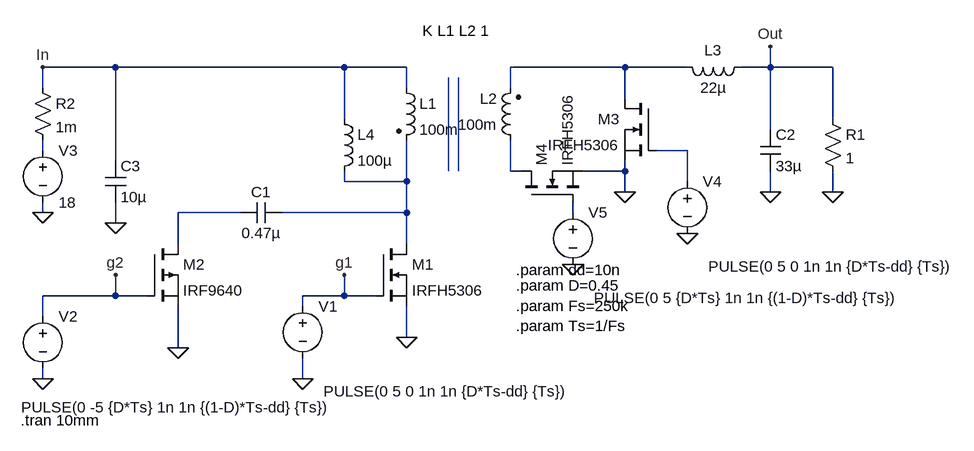
[diagram p0: schematic Forward Active Clamping.asc]
Forward Active Clamping.asc, the LTspice schematic file:
Version 4
SHEET 1 1224 680
WIRE -112 -48 -224 -48
WIRE 240 -48 -112 -48
WIRE 336 -48 240 -48
WIRE 672 -48 496 -48
WIRE 768 -48 672 -48
WIRE 896 -48 896 -80
WIRE 896 -48 848 -48
WIRE 992 -48 896 -48
WIRE -224 -16 -224 -48
WIRE 336 -16 336 -48
WIRE 496 -16 496 -48
WIRE 672 0 672 -48
WIRE 240 32 240 -48
WIRE 992 32 992 -48
WIRE 896 48 896 -48
WIRE -224 80 -224 64
WIRE 768 80 720 80
WIRE -112 96 -112 -48
WIRE 400 112 400 -32
WIRE 416 112 416 -32
WIRE 496 112 496 64
WIRE 512 112 496 112
WIRE 672 112 672 96
WIRE 672 112 608 112
WIRE 240 128 240 112
WIRE 336 128 336 64
WIRE 336 128 240 128
WIRE 768 128 768 80
WIRE 672 144 672 112
WIRE 896 144 896 112
WIRE 992 144 992 112
WIRE -224 176 -224 160
WIRE 80 176 -16 176
WIRE 336 176 336 128
WIRE 336 176 144 176
WIRE 592 176 592 160
WIRE -112 192 -112 160
WIRE -16 224 -16 176
WIRE 336 224 336 176
WIRE -112 304 -112 272
WIRE -112 304 -224 304
WIRE -64 304 -112 304
WIRE 240 304 240 272
WIRE 240 304 176 304
WIRE 288 304 240 304
WIRE 176 320 176 304
WIRE -224 336 -224 304
WIRE 336 368 336 320
WIRE -16 384 -16 320
WIRE -224 432 -224 416
WIRE 176 432 176 400
FLAG 176 432 0
FLAG 336 368 0
FLAG -224 432 0
FLAG -16 384 0
FLAG 896 144 0
FLAG 672 144 0
FLAG 992 144 0
FLAG 896 -80 Out
FLAG -224 -48 In
FLAG -224 176 0
FLAG -112 192 0
FLAG 240 272 g1
FLAG -112 272 g2
FLAG 768 208 0
FLAG 592 256 0
SYMBOL nmos 288 224 R0
SYMATTR InstName M1
SYMATTR Value IRFH5306
SYMBOL pmos -64 224 R0
SYMATTR InstName M2
SYMATTR Value IRF9640
SYMBOL voltage 176 304 R0
WINDOW 3 32 147 Left 2
WINDOW 123 0 0 Left 0
WINDOW 39 0 0 Left 0
SYMATTR InstName V1
SYMATTR Value PULSE(0 5 0 1n 1n {D*Ts-dd} {Ts})
SYMBOL voltage -224 320 R0
WINDOW 3 -33 156 Left 2
WINDOW 123 0 0 Left 0
WINDOW 39 0 0 Left 0
SYMATTR InstName V2
SYMATTR Value PULSE(0 -5 {D*Ts} 1n 1n {(1-D)*Ts-dd} {Ts})
SYMBOL cap 144 160 R90
WINDOW 0 0 32 VBottom 2
WINDOW 3 32 32 VTop 2
SYMATTR InstName C1
SYMATTR Value 0.47µ
SYMATTR SpiceLine V=10 Irms=1.19 Rser=0.0746214 Lser=0 mfg="KEMET" pn="C0603C474K8RAC" type="X7R"
SYMBOL cap 880 48 R0
SYMATTR InstName C2
SYMATTR Value 33µ
SYMBOL ind2 320 -32 R0
SYMATTR InstName L1
SYMATTR Value 100m
SYMATTR Type ind
SYMBOL ind2 512 80 R180
WINDOW 0 36 80 Left 2
WINDOW 3 36 40 Left 2
SYMATTR InstName L2
SYMATTR Value 100m
SYMATTR Type ind
SYMBOL ind 864 -64 R90
WINDOW 0 5 56 VBottom 2
WINDOW 3 32 56 VTop 2
SYMATTR InstName L3
SYMATTR Value 22µ
SYMATTR SpiceLine Ipk=0.3 Rser=0.11 Rpar=3645.14 Cpar=0 mfg="Bourns, Inc." pn="SRR6603-220ML"
SYMBOL res 976 16 R0
SYMATTR InstName R1
SYMATTR Value 1
SYMBOL voltage -224 64 R0
SYMATTR InstName V3
SYMATTR Value 18
SYMBOL res -240 -32 R0
SYMATTR InstName R2
SYMATTR Value 1m
SYMBOL cap -128 96 R0
SYMATTR InstName C3
SYMATTR Value 10µ
SYMBOL ind 224 16 R0
SYMATTR InstName L4
SYMATTR Value 100µ
SYMBOL nmos 720 0 M0
SYMATTR InstName M3
SYMATTR Value IRFH5306
SYMBOL voltage 768 112 R0
WINDOW 3 32 147 Left 2
WINDOW 123 0 0 Left 0
WINDOW 39 0 0 Left 0
SYMATTR InstName V4
SYMATTR Value PULSE(0 5 0 1n 1n {D*Ts-dd} {Ts})
SYMBOL nmos 512 160 R270
SYMATTR InstName M4
SYMATTR Value IRFH5306
SYMBOL voltage 592 160 R0
WINDOW 3 32 147 Left 2
WINDOW 123 0 0 Left 0
WINDOW 39 0 0 Left 0
SYMATTR InstName V5
SYMATTR Value PULSE(0 5 {D*Ts} 1n 1n {(1-D)*Ts-dd} {Ts})
TEXT 504 288 Left 2 !.param D=0.45\n.param Fs=250k\n.param Ts=1/Fs
TEXT 360 -104 Left 2 !K L1 L2 1
TEXT -258 496 Left 2 !.tran 10mm
TEXT 504 264 Left 2 !.param dd=10n

The netlist it stands for:
* Forward Active Clamping.asc
M1 N007 g1 0 0 IRFH5306
M2 N008 g2 0 0 IRF9640
V1 g1 0 PULSE(0 5 0 1n 1n {D*Ts-dd} {Ts})
V2 g2 0 PULSE(0 -5 {D*Ts} 1n 1n {(1-D)*Ts-dd} {Ts})
C1 N007 N008 0.47µ V=10 Irms=1.19 Rser=0.0746214 Lser=0 mfg="KEMET" pn="C0603C474K8RAC" type="X7R"
C2 Out 0 33µ
L1 In N007 100m
L2 N006 N001 100m
L3 Out N001 22µ Ipk=0.3 Rser=0.11 Rpar=3645.14 Cpar=0 mfg="Bourns, Inc." pn="SRR6603-220ML"
R1 Out 0 1
V3 N002 0 18
R2 In N002 1m
C3 In 0 10µ
L4 In N007 100µ
M3 N001 N003 0 0 IRFH5306
V4 N003 0 PULSE(0 5 0 1n 1n {D*Ts-dd} {Ts})
M4 N006 N009 0 0 IRFH5306
V5 N009 0 PULSE(0 5 {D*Ts} 1n 1n {(1-D)*Ts-dd} {Ts})
.model NMOS NMOS
.model PMOS PMOS
.lib standard.mos
.param D=0.45
.param Fs=250k
.param Ts=1/Fs
K L1 L2 1
.tran 10mm
.param dd=10n
.backanno
.end